# Altium project Assignment2.PrjPcb (part 2 of 2)

## Sheet SCH - Peripheral.SchDoc
size A4; CompanyName: James Cook University; DrawnBy1: Liam McLaren; Organization: James Cook University; Title1: Assignment 2 - qfuse; Revision: 1.6; SheetNumber: 3; SheetTotal: 4; Title2: IMU & Oscillator; DrawnBy2: Jacob Finger; ProjectName: *ProjectName
Used 3 times, as channels Designator, Designator, Designator. Parts and nets are listed once, with the designators drawn on the sheet.
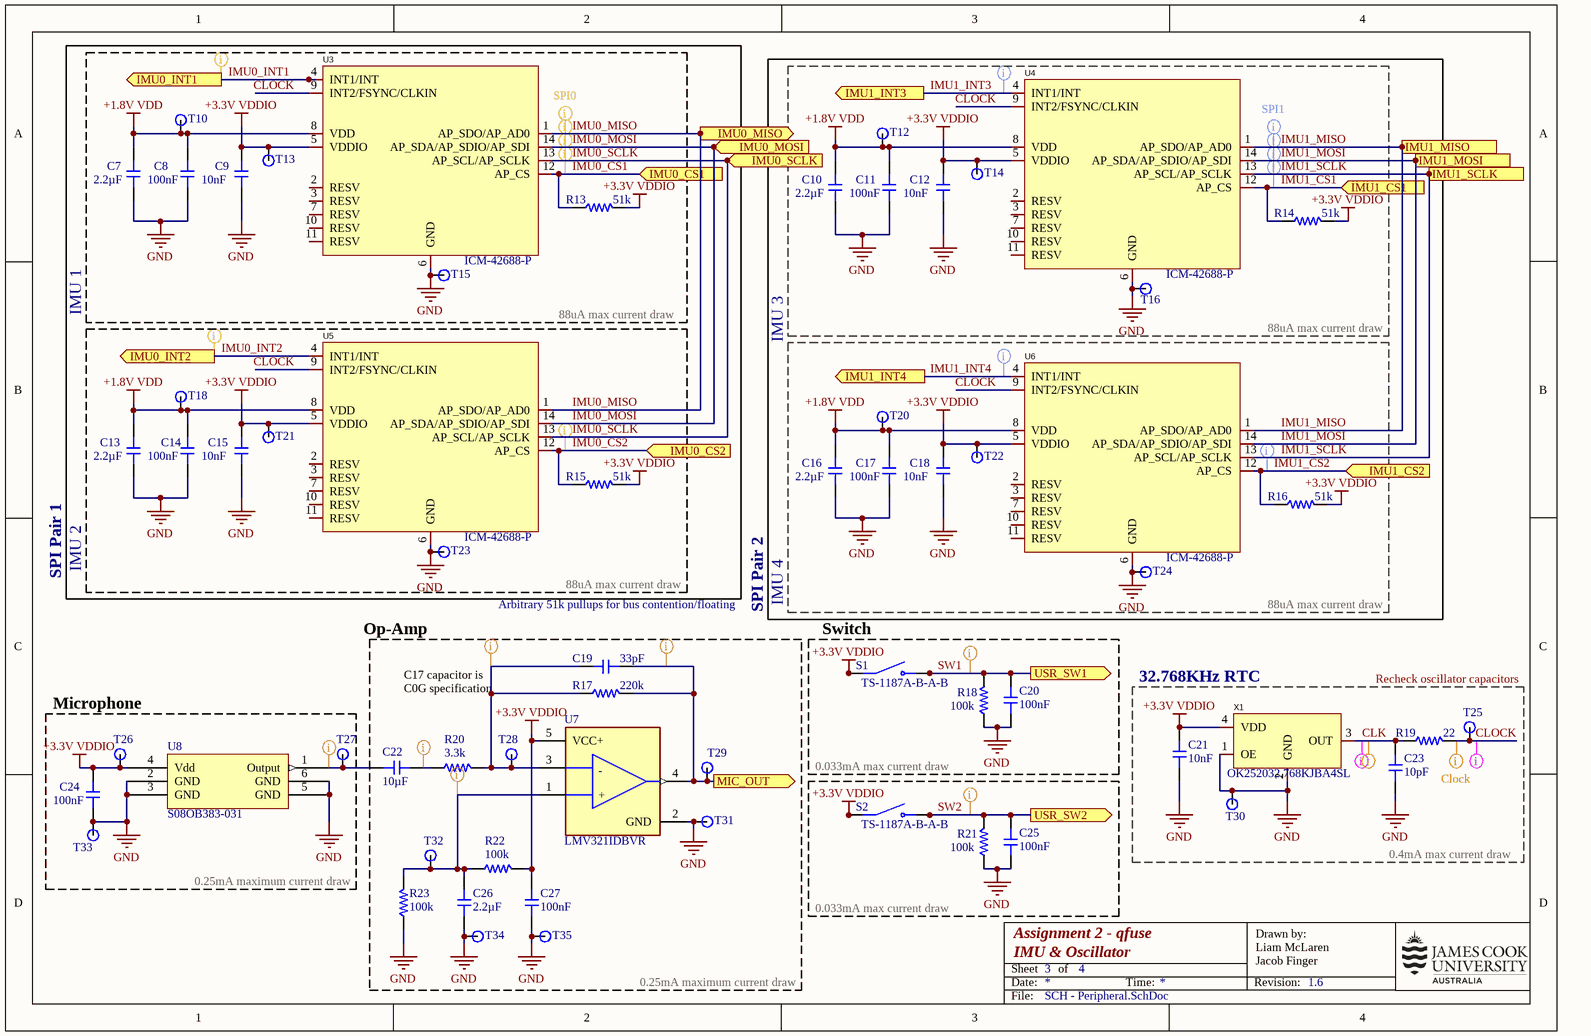
[diagram p2: SCH - Peripheral.SchDoc]

### Parts
C7  value 2.2µF  [CAP-0402]  (hidden comment: CL05A225MQ5NSNC)
C8  value 100nF  [CAP-0402]  (hidden comment: CL05B104KB54PNC)
C9  value 10nF  [CAP-0402]  (hidden comment: CL05B103KB5NNNC)
C10  value 2.2µF  [CAP-0402]  (hidden comment: CL05A225MQ5NSNC)
C11  value 100nF  [CAP-0402]  (hidden comment: CL05B104KB54PNC)
C12  value 10nF  [CAP-0402]  (hidden comment: CL05B103KB5NNNC)
C13  value 2.2µF  [CAP-0402]  (hidden comment: CL05A225MQ5NSNC)
C14  value 100nF  [CAP-0402]  (hidden comment: CL05B104KB54PNC)
C15  value 10nF  [CAP-0402]  (hidden comment: CL05B103KB5NNNC)
C16  value 2.2µF  [CAP-0402]  (hidden comment: CL05A225MQ5NSNC)
C17  value 100nF  [CAP-0402]  (hidden comment: CL05B104KB54PNC)
C18  value 10nF  [CAP-0402]  (hidden comment: CL05B103KB5NNNC)
C19  value 33pF  [CAP-0402]  (hidden comment: 0402CG330J500NT)
C20  value 100nF  [CAP-0402]  (hidden comment: CL05B104KO5NNNC)
C21  value 10nF  [CAP-0402]  (hidden comment: CL05B103KB5NNNC)
C22  value 10µF  [CAP-0402]  (hidden comment: CL05A106MQ5NUNC)
C23  value 10pF  [CAP-0402]  (hidden comment: CL05C100JB5NNNC)
C24  value 100nF  [CAP-0402]  (hidden comment: CL05B104KB54PNC)
C25  value 100nF  [CAP-0402]  (hidden comment: CL05B104KO5NNNC)
C26  value 2.2µF  [CAP-0402]  (hidden comment: CL05A225MQ5NSNC)
C27  value 100nF  [CAP-0402]  (hidden comment: CL05B104KB54PNC)
R13  value 51k  [RES-0402]  (hidden comment: 0402WGF5102TCE)
R14  value 51k  [RES-0402]  (hidden comment: 0402WGF5102TCE)
R15  value 51k  [RES-0402]  (hidden comment: 0402WGF5102TCE)
R16  value 51k  [RES-0402]  (hidden comment: 0402WGF5102TCE)
R17  value 220k  [RES-0603]  (hidden comment: 0603WAF2203T5E)
R18  value 100k  [RES-0402]  (hidden comment: 0402WGF1003TCE)
R19  value 22  [RES-0402]  (hidden comment: 0402WGF220JTCE)
R20  value 3.3k  [RES-0402]  (hidden comment: 0402WGF3301TCE)
R21  value 100k  [RES-0402]  (hidden comment: 0402WGF1003TCE)
R22  value 100k  [RES-0402]  (hidden comment: 0402WGF1003TCE)
R23  value 100k  [RES-0402]  (hidden comment: 0402WGF1003TCE)
S1  TS-1187A-B-A-B  [SW_TS-1187A-B-A-B]
S2  TS-1187A-B-A-B  [SW_TS-1187A-B-A-B]
T10  TP  [TestPoint]  (value not drawn)  (no BOM)
T12  TP  [TestPoint]  (value not drawn)  (no BOM)
T13  TP  [TestPoint]  (value not drawn)  (no BOM)
T14  TP  [TestPoint]  (value not drawn)  (no BOM)
T15  TP  [TestPoint]  (value not drawn)  (no BOM)
T16  TP  [TestPoint]  (value not drawn)  (no BOM)
T18  TP  [TestPoint]  (value not drawn)  (no BOM)
T20  TP  [TestPoint]  (value not drawn)  (no BOM)
T21  TP  [TestPoint]  (value not drawn)  (no BOM)
T22  TP  [TestPoint]  (value not drawn)  (no BOM)
T23  TP  [TestPoint]  (value not drawn)  (no BOM)
T24  TP  [TestPoint]  (value not drawn)  (no BOM)
T25  TP  [TestPoint]  (value not drawn)  (no BOM)
T26  TP  [TestPoint]  (value not drawn)  (no BOM)
T27  TP  [TestPoint]  (value not drawn)  (no BOM)
T28  TP  [TestPoint]  (value not drawn)  (no BOM)
T29  TP  [TestPoint]  (value not drawn)  (no BOM)
T30  TP  [TestPoint]  (value not drawn)  (no BOM)
T31  TP  [TestPoint]  (value not drawn)  (no BOM)
T32  TP  [TestPoint]  (value not drawn)  (no BOM)
T33  TP  [TestPoint]  (value not drawn)  (no BOM)
T34  TP  [TestPoint]  (value not drawn)  (no BOM)
T35  TP  [TestPoint]  (value not drawn)  (no BOM)
U3  ICM-42688-P  [LGA-14_L3.0-W2.5-P0.50-TL]
U4  ICM-42688-P  [LGA-14_L3.0-W2.5-P0.50-TL]
U5  ICM-42688-P  [LGA-14_L3.0-W2.5-P0.50-TL]
U6  ICM-42688-P  [LGA-14_L3.0-W2.5-P0.50-TL]
U7  LMV321IDBVR  [FP-DBV0005A-MFG]
U8  S08OB383-031  [Goertek_S08OB381-026]
X1  OK252032.768KJBA4SL  [OSC-SMD_4P-L2.5-W2.0-BL]

### Blocks framed on the sheet
IMU 1: C7-C9 R13 T10 T13 T15 U3
88uA max current draw: C10-C12 R14 T12 T14 T16 U4
0.25mA maximum current draw: C19 C22 C26 C27 R17 R20 R22 R23 T28 T29 T31 T32 T34 T35 U7
Switch: C20 R18 S1
Microphone: C24 T26 T27 T33 U8
32.768KHz RTC: C21 C23 R19 T25 T30 X1

### Ports
IMU0_CS1 (in, see SCH - Compute, Flash[3A], SCH - Power, Connector[4B]), IMU0_CS2 (in, see SCH - Compute, Flash[3A], SCH - Power, Connector[4B]), IMU0_INT1 (out, see SCH - Compute, Flash[3A], SCH - Power, Connector[4B]), IMU0_INT2 (out, see SCH - Compute, Flash[3A], SCH - Power, Connector[4A]), IMU0_MISO (out, see SCH - Compute, Flash[3A], SCH - Power, Connector[3B]), IMU0_MOSI (in, see SCH - Compute, Flash[3A], SCH - Power, Connector[3A]), IMU0_SCLK (in, see SCH - Compute, Flash[3A], SCH - Power, Connector[3B]), IMU1_CS1 (in, see SCH - Compute, Flash[3A], SCH - Power, Connector[4A]), IMU1_CS2 (in, see SCH - Compute, Flash[3B], SCH - Power, Connector[3A]), IMU1_INT3 (out, see SCH - Compute, Flash[3B], SCH - Power, Connector[4B]), IMU1_INT4 (out, see SCH - Compute, Flash[3B], SCH - Power, Connector[3B]), IMU1_MISO (out, see SCH - Compute, Flash[3B], SCH - Power, Connector[3B]), IMU1_MOSI (in, see SCH - Compute, Flash[3B], SCH - Power, Connector[4B]), IMU1_SCLK (in, see SCH - Compute, Flash[3A], SCH - Power, Connector[4B]), MIC_OUT (out, see SCH - Compute, Flash[3B]), USR_SW1 (out, see SCH - Compute, Flash[3B], SCH - Power, Connector[3B]), USR_SW2 (out, see SCH - Compute, Flash[3B], SCH - Power, Connector[3B])

### Nets
+1.8V VDD: C7.2 C8.2 C10.2 C11.2 C13.2 C14.2 C16.2 C17.2 T10.1(TP) T12.1(TP) T18.1(TP) T20.1(TP) U3.8(VDD) U4.8(VDD) U5.8(VDD) U6.8(VDD)
+3.3V VDDIO: C9.2 C12.2 C15.2 C18.2 C21.2 C24.2 C27.2 R13.2 R14.2 R15.2 R16.2 R22.2 S1.A(COM) S1.B(COM) S2.A(COM) S2.B(COM) T13.1(TP) T14.1(TP) T21.1(TP) T22.1(TP) T26.1(TP) U3.5(VDDIO) U4.5(VDDIO) U5.5(VDDIO) U6.5(VDDIO) U7.5(VCC+) U8.4(Vdd) X1.4(VDD)
GND: C7.1 C8.1 C9.1 C10.1 C11.1 C12.1 C13.1 C14.1 C15.1 C16.1 C17.1 C18.1 C20.1 C21.1 C23.1 C24.1 C25.1 C26.1 C27.1 R18.1 R21.1 R23.1 T15.1(TP) T16.1(TP) T23.1(TP) T24.1(TP) T30.1(TP) T31.1(TP) T33.1(TP) T34.1(TP) T35.1(TP) U3.6(GND) U4.6(GND) U5.6(GND) U6.6(GND) U7.2(GND) U8.2(GND) U8.3(GND) U8.5(GND) U8.6(GND) X1.1(OE) X1.2(GND)
CLK: C23.2 R19.1 X1.3(OUT)
CLOCK: R19.2 T25.1(TP) U3.9(INT2/FSYNC/CLKIN) U4.9(INT2/FSYNC/CLKIN) U5.9(INT2/FSYNC/CLKIN) U6.9(INT2/FSYNC/CLKIN)
IMU0_CS1: R13.1 U3.12(AP_CS) ; port IMU0_CS1
IMU0_CS2: R15.1 U5.12(AP_CS) ; port IMU0_CS2
IMU0_INT1: U3.4(INT1/INT) ; port IMU0_INT1
IMU0_INT2: U5.4(INT1/INT) ; port IMU0_INT2
IMU0_MISO: U3.1(AP_SDO/AP_AD0) U5.1(AP_SDO/AP_AD0) ; port IMU0_MISO
IMU0_MOSI: U3.14(AP_SDA/AP_SDIO/AP_SDI) U5.14(AP_SDA/AP_SDIO/AP_SDI) ; port IMU0_MOSI
IMU0_SCLK: U3.13(AP_SCL/AP_SCLK) U5.13(AP_SCL/AP_SCLK) ; port IMU0_SCLK
IMU1_CS1: R14.1 U4.12(AP_CS) ; port IMU1_CS1
IMU1_CS2: R16.1 U6.12(AP_CS) ; port IMU1_CS2
IMU1_INT3: U4.4(INT1/INT) ; port IMU1_INT3
IMU1_INT4: U6.4(INT1/INT) ; port IMU1_INT4
IMU1_MISO: U4.1(AP_SDO/AP_AD0) U6.1(AP_SDO/AP_AD0) ; port IMU1_MISO
IMU1_MOSI: U4.14(AP_SDA/AP_SDIO/AP_SDI) U6.14(AP_SDA/AP_SDIO/AP_SDI) ; port IMU1_MOSI
IMU1_SCLK: U4.13(AP_SCL/AP_SCLK) U6.13(AP_SCL/AP_SCLK) ; port IMU1_SCLK
MIC_OUT: C19.2 R17.2 T29.1(TP) U7.4(OUT) ; port MIC_OUT
SW1: C20.2 R18.2 S1.C(NO) S1.D(NO) ; port USR_SW1
SW2: C25.2 R21.2 S2.C(NO) S2.D(NO) ; port USR_SW2
NetC19_1: C19.1 R17.1 R20.2 T28.1(TP) U7.3(1IN-)
NetC22_1: C22.1 T27.1(TP) U8.1(Output)
NetC22_2: C22.2 R20.1
NetC26_2: C26.2 R22.1 R23.2 T32.1(TP) U7.1(1IN+)

Not connected (* = marked no-connect by the designer): U3 2(RESV) 3(RESV) 7(RESV) 10(RESV) 11(RESV); U4 2(RESV) 3(RESV) 7(RESV) 10(RESV) 11(RESV); U5 2(RESV) 3(RESV) 7(RESV) 10(RESV) 11(RESV); U6 2(RESV) 3(RESV) 7(RESV) 10(RESV) 11(RESV)

### Channels
Designator: designators end in _Designator#1; ports IMU0_CS1=IMU0_CS1 IMU0_CS2=IMU0_CS2 IMU0_INT1=IMU0_INT1 IMU0_INT2=IMU0_INT2 IMU0_MISO=IMU0_MISO IMU0_MOSI=IMU0_MOSI IMU0_SCLK=IMU0_SCLK IMU1_CS1=IMU1_CS1 IMU1_CS2=IMU1_CS2 IMU1_INT3=IMU1_INT3 IMU1_INT4=IMU1_INT4 IMU1_MISO=IMU1_MISO IMU1_MOSI=IMU1_MOSI IMU1_SCLK=IMU1_SCLK MIC_OUT=MIC_IN USR_SW1=SW1 USR_SW2=SW2
Designator: designators end in _Designator#2; ports IMU0_CS1=IMU0_CS1 IMU0_CS2=IMU0_CS2 IMU0_INT1=IMU0_INT1 IMU0_INT2=IMU0_INT2 IMU0_MISO=IMU0_MISO IMU0_MOSI=IMU0_MOSI IMU0_SCLK=IMU0_SCLK IMU1_CS1=IMU1_CS1 IMU1_CS2=IMU1_CS2 IMU1_INT3=IMU1_INT3 IMU1_INT4=IMU1_INT4 IMU1_MISO=IMU1_MISO IMU1_MOSI=IMU1_MOSI IMU1_SCLK=IMU1_SCLK MIC_OUT=MIC_IN USR_SW1=SW1 USR_SW2=SW2
Designator: designators end in _Designator#3; ports IMU0_CS1=IMU0_CS1 IMU0_CS2=IMU0_CS2 IMU0_INT1=IMU0_INT1 IMU0_INT2=IMU0_INT2 IMU0_MISO=IMU0_MISO IMU0_MOSI=IMU0_MOSI IMU0_SCLK=IMU0_SCLK IMU1_CS1=IMU1_CS1 IMU1_CS2=IMU1_CS2 IMU1_INT3=IMU1_INT3 IMU1_INT4=IMU1_INT4 IMU1_MISO=IMU1_MISO IMU1_MOSI=IMU1_MOSI IMU1_SCLK=IMU1_SCLK MIC_OUT=MIC_IN USR_SW1=SW1 USR_SW2=SW2

### Layout directives
net class Signals: CLK_Designator, CLOCK_Designator, MIC_IN, NetC19_Designator#1_1, NetC22_Designator#1_1, NetC22_Designator#1_2, NetC26_Designator#1_2, SW1, SW2
net class Clock: CLK_Designator, CLOCK_Designator
net class SPI0: IMU0_CS1, IMU0_CS2, IMU0_INT1, IMU0_INT2, IMU0_MISO, IMU0_MOSI, IMU0_SCLK
net class SPI1: IMU1_CS1, IMU1_CS2, IMU1_INT3, IMU1_INT4, IMU1_MISO, IMU1_MOSI, IMU1_SCLK

### Notes on the sheet
- 88uA max current draw
- IMU 3
- SPI Pair 1
- IMU 2
- Op-Amp
- Arbitrary 51k pullups for bus contention/floating
- SPI Pair 2
- IMU 4
- C17 capacitor is C0G specification
- Recheck oscillator capacitors
- 0.033mA max current draw
- (near R23) 0.25mA maximum current draw
- 0.4mA max current draw
- Date:
- Sheet
- of
- Time:
- Revision:
- Drawn by:
- File:
- (in symbol CMP-00012-2) +

### Library data of the parts
C7 C10 C13 C16 C26 = CMP-001-00142-3: Capacitor, Ceramic (MLCC), 2.2uF, ±20%, 6.3V, X5R, ±20%, SMD 0402; Manufacturer: Samsung Electro-Mechanics; Category: Capacitors - MLCC; Case/Package: 0402; ComponentLink1URL: https://datasheet.lcsc.com/lcsc/1811021410_Samsung-Electro-Mechanics-CL05A225MQ5NSNC_C12530.pdf; Temperature Coefficient: X5R; Tolerance: 20%; Design Item ID: CL05A225MQ5NSNC; JLCPCB Part Number: C12530; Voltage Rating: 6.3V; ComponentLink1Description: Datasheet; ComponentLink2URL: https://jlcpcb.com/partdetail/C12530; Source: jlcpcb_capacitors_basic.schlib; Manufacturer Part Number: CL05A225MQ5NSNC; RoHS: Yes; ComponentLink2Description: JLCPCB Part URL; ComponentLink3Description: LCSC Part URL; JLCPCB Basic Part: Yes; ComponentLink3URL: https://lcsc.com/product-detail/Multilayer-Ceramic-Capacitors-MLCC---SMD-SMT_Samsung-Electro-Mechanics-Samsung-Electro-Mechanics-CL05A225MQ5NSNC_C12530.html
C8 C11 C14 C17 C24 C27 = CMP-001-00146-3: Capacitor, Ceramic (MLCC), 100nF, ±10%, 50V, X7R, ±10%, SMD 0402; Manufacturer: Samsung Electro-Mechanics; Source: jlcpcb_capacitors_basic.schlib; ComponentLink2URL: https://jlcpcb.com/partdetail/C307331; JLCPCB Part Number: C307331; JLCPCB Basic Part: Yes; Voltage Rating: 50V; Manufacturer Part Number: CL05B104KB54PNC; RoHS: Yes; Case/Package: 0402; Temperature Coefficient: X7R; ComponentLink1URL: https://datasheet.lcsc.com/lcsc/1810191222_Samsung-Electro-Mechanics-CL05B104KB54PNC_C307331.pdf; Category: Capacitors - MLCC; ComponentLink2Description: JLCPCB Part URL; ComponentLink3Description: LCSC Part URL; Design Item ID: CL05B104KB54PNC; ComponentLink3URL: https://lcsc.com/product-detail/Multilayer-Ceramic-Capacitors-MLCC---SMD-SMT_Samsung-Electro-Mechanics-Samsung-Electro-Mechanics-CL05B104KB54PNC_C307331.html; ComponentLink1Description: Datasheet; Tolerance: 10%
C9 C12 C15 C18 C21 = CMP-001-00145-3: Capacitor, Ceramic (MLCC), 10nF, ±10%, 50V, X7R, ±10%, SMD 0402; Manufacturer: Samsung Electro-Mechanics; JLCPCB Part Number: C15195; Case/Package: 0402; ComponentLink1URL: https://datasheet.lcsc.com/lcsc/1810191223_Samsung-Electro-Mechanics-CL05B103KB5NNNC_C15195.pdf; ComponentLink3Description: LCSC Part URL; Design Item ID: CL05B103KB5NNNC; Source: jlcpcb_capacitors_basic.schlib; JLCPCB Basic Part: Yes; Voltage Rating: 50V; RoHS: Yes; Tolerance: 10%; ComponentLink1Description: Datasheet; ComponentLink3URL: https://lcsc.com/product-detail/Multilayer-Ceramic-Capacitors-MLCC---SMD-SMT_Samsung-Electro-Mechanics-Samsung-Electro-Mechanics-CL05B103KB5NNNC_C15195.html; Category: Capacitors - MLCC; ComponentLink2Description: JLCPCB Part URL; ComponentLink2URL: https://jlcpcb.com/partdetail/C15195; Temperature Coefficient: X7R; Manufacturer Part Number: CL05B103KB5NNNC
C19 = CMP-001-00127-3: Capacitor, Ceramic (MLCC), 33pF, ±5%, 50V, C0G, ±5%, SMD 0402; Manufacturer: FH(Guangdong Fenghua Advanced Tech); ComponentLink3URL: https://lcsc.com/product-detail/Multilayer-Ceramic-Capacitors-MLCC---SMD-SMT_FH-Guangdong-Fenghua-Advanced-Tech-FH-Guangdong-Fenghua-Advanced-Tech-0402CG330J500NT_C1562.html; Tolerance: 5%; ComponentLink1URL: https://datasheet.lcsc.com/lcsc/1811141731_FH--Guangdong-Fenghua-Advanced-Tech-0402CG330J500NT_C1562.pdf; Source: jlcpcb_capacitors_basic.schlib; ComponentLink2URL: https://jlcpcb.com/partdetail/C1562; ComponentLink2Description: JLCPCB Part URL; RoHS: Yes; Design Item ID: 0402CG330J500NT; Manufacturer Part Number: 0402CG330J500NT; Voltage Rating: 50V; JLCPCB Basic Part: Yes; Case/Package: 0402; Category: Capacitors - MLCC; ComponentLink3Description: LCSC Part URL; JLCPCB Part Number: C1562; ComponentLink1Description: Datasheet; Temperature Coefficient: C0G
C20 C25 = CMP-001-00147-3: Capacitor, Ceramic (MLCC), 100nF, ±10%, 16V, X7R, ±10%, SMD 0402; Manufacturer: Samsung Electro-Mechanics; Manufacturer Part Number: CL05B104KO5NNNC; ComponentLink1Description: Datasheet; RoHS: Yes; Voltage Rating: 16V; ComponentLink2URL: https://jlcpcb.com/partdetail/C1525; Temperature Coefficient: X7R; ComponentLink2Description: JLCPCB Part URL; JLCPCB Part Number: C1525; ComponentLink3URL: https://lcsc.com/product-detail/Multilayer-Ceramic-Capacitors-MLCC---SMD-SMT_Samsung-Electro-Mechanics-Samsung-Electro-Mechanics-CL05B104KO5NNNC_C1525.html; ComponentLink3Description: LCSC Part URL; Source: jlcpcb_capacitors_basic.schlib; Design Item ID: CL05B104KO5NNNC; Category: Capacitors - MLCC; ComponentLink1URL: https://datasheet.lcsc.com/lcsc/1810191219_Samsung-Electro-Mechanics-CL05B104KO5NNNC_C1525.pdf; JLCPCB Basic Part: Yes; Tolerance: 10%; Case/Package: 0402
C22 = CMP-001-00141-3: Capacitor, Ceramic (MLCC), 10uF, ±20%, 6.3V, X5R, ±20%, SMD 0402; Manufacturer: Samsung Electro-Mechanics; JLCPCB Part Number: C15525; Tolerance: 20%; Temperature Coefficient: X5R; ComponentLink2Description: JLCPCB Part URL; ComponentLink3Description: LCSC Part URL; Voltage Rating: 6.3V; ComponentLink1Description: Datasheet; ComponentLink1URL: https://datasheet.lcsc.com/lcsc/2208231630_Samsung-Electro-Mechanics-CL05A106MQ5NUNC_C15525.pdf; RoHS: Yes; Case/Package: 0402; ComponentLink2URL: https://jlcpcb.com/partdetail/C15525; Manufacturer Part Number: CL05A106MQ5NUNC; Design Item ID: CL05A106MQ5NUNC; Source: jlcpcb_capacitors_basic.schlib; Category: Capacitors - MLCC; ComponentLink3URL: https://lcsc.com/product-detail/Multilayer-Ceramic-Capacitors-MLCC---SMD-SMT_Samsung-Electro-Mechanics-Samsung-Electro-Mechanics-CL05A106MQ5NUNC_C15525.html; JLCPCB Basic Part: Yes
C23 = CMP-001-00150-3: Capacitor, Ceramic (MLCC), 10pF, ±5%, 50V, C0G, ±5%, SMD 0402; Manufacturer: Samsung Electro-Mechanics; ComponentLink3Description: LCSC Part URL; Category: Capacitors - MLCC; ComponentLink1Description: Datasheet; RoHS: Yes; JLCPCB Part Number: C32949; ComponentLink3URL: https://lcsc.com/product-detail/Multilayer-Ceramic-Capacitors-MLCC---SMD-SMT_Samsung-Electro-Mechanics-Samsung-Electro-Mechanics-CL05C100JB5NNNC_C32949.html; Source: jlcpcb_capacitors_basic.schlib; Manufacturer Part Number: CL05C100JB5NNNC; ComponentLink2URL: https://jlcpcb.com/partdetail/C32949; JLCPCB Basic Part: Yes; ComponentLink1URL: https://datasheet.lcsc.com/lcsc/1810191220_Samsung-Electro-Mechanics-CL05C100JB5NNNC_C32949.pdf; Design Item ID: CL05C100JB5NNNC; Voltage Rating: 50V; Temperature Coefficient: C0G; Tolerance: 5%; ComponentLink2Description: JLCPCB Part URL; Case/Package: 0402
R13-R16 = CMP-009-00226-4: Resistor, 51kΩ, ±1%, 62.5mW, 50V, ±100ppm/℃, -55℃~+155℃, SMD 0402; Manufacturer: Uniroyal; Temperature Rating: -55℃~+155℃; Category: Resistors; ComponentLink1URL: https://datasheet.lcsc.com/lcsc/2206010100_UNI-ROYAL-Uniroyal-Elec-0402WGF5102TCE_C25794.pdf; JLCPCB Part Number: C25794; Manufacturer Part Number: 0402WGF5102TCE; Voltage Rating: 50V; Case/Package: 0402; Design Item ID: 0402WGF5102TCE; JLCPCB Basic Part: Yes; ComponentLink2Description: JLCPCB Part URL; Tolerance: 1%; ComponentLink2URL: https://jlcpcb.com/partdetail/C25794; Temperature Coefficient: ±100ppm/℃; Source: jlcpcb_resistors_basic.schlib; ComponentLink1Description: Datasheet; Power Rating: 62.5mW
R17 = CMP-009-00277-2: Resistor, 220kΩ, ±1%, 100mW, 75V, ±100ppm/℃, -55℃~+155℃, SMD 0603; Manufacturer: Uniroyal; Temperature Coefficient: ±100ppm/℃; Tolerance: 1%; ComponentLink2URL: https://jlcpcb.com/partdetail/C22961; Source: jlcpcb_resistors_basic.schlib; Case/Package: 0603; Category: Resistors; Manufacturer Part Number: 0603WAF2203T5E; Voltage Rating: 75V; Design Item ID: 0603WAF2203T5E; ComponentLink1URL: https://datasheet.lcsc.com/lcsc/2206010130_UNI-ROYAL-Uniroyal-Elec-0603WAF2203T5E_C22961.pdf; JLCPCB Part Number: C22961; Power Rating: 100mW; ComponentLink1Description: Datasheet; ComponentLink2Description: JLCPCB Part URL; Temperature Rating: -55℃~+155℃; JLCPCB Basic Part: Yes
R18 R21-R23 = CMP-009-00182-4: Resistor, 100kΩ, ±1%, 62.5mW, 50V, ±100ppm/℃, -55℃~+155℃, SMD 0402; Manufacturer: Uniroyal; ComponentLink1Description: Datasheet; Voltage Rating: 50V; ComponentLink2URL: https://jlcpcb.com/partdetail/C25741; Design Item ID: 0402WGF1003TCE; Tolerance: 1%; Case/Package: 0402; Manufacturer Part Number: 0402WGF1003TCE; ComponentLink2Description: JLCPCB Part URL; Source: jlcpcb_resistors_basic.schlib; JLCPCB Basic Part: Yes; Temperature Coefficient: ±100ppm/℃; Category: Resistors; Temperature Rating: -55℃~+155℃; JLCPCB Part Number: C25741; ComponentLink1URL: https://datasheet.lcsc.com/lcsc/2206010100_UNI-ROYAL-Uniroyal-Elec-0402WGF1003TCE_C25741.pdf; Power Rating: 62.5mW
R19 = CMP-009-00204-4: Resistor, 22Ω, ±1%, 62.5mW, 50V, ±200ppm/℃, -55℃~+155℃, SMD 0402; Manufacturer: Uniroyal; ComponentLink1URL: https://datasheet.lcsc.com/lcsc/2205311900_UNI-ROYAL-Uniroyal-Elec-0402WGF220JTCE_C25092.pdf; Source: jlcpcb_resistors_basic.schlib; ComponentLink2URL: https://jlcpcb.com/partdetail/C25092; Design Item ID: 0402WGF220JTCE; Temperature Rating: -55℃~+155℃; Manufacturer Part Number: 0402WGF220JTCE; Temperature Coefficient: ±200ppm/℃; JLCPCB Part Number: C25092; Case/Package: 0402; ComponentLink2Description: JLCPCB Part URL; Power Rating: 62.5mW; JLCPCB Basic Part: Yes; Category: Resistors; ComponentLink1Description: Datasheet; Voltage Rating: 50V; Tolerance: 1%
R20 = CMP-009-00211-4: Resistor, 3.3kΩ, ±1%, 62.5mW, 50V, ±100ppm/℃, -55℃~+155℃, SMD 0402; Manufacturer: Uniroyal; JLCPCB Part Number: C25890; Design Item ID: 0402WGF3301TCE; Temperature Rating: -55℃~+155℃; Voltage Rating: 50V; JLCPCB Basic Part: Yes; Power Rating: 62.5mW; Source: jlcpcb_resistors_basic.schlib; ComponentLink2Description: JLCPCB Part URL; Temperature Coefficient: ±100ppm/℃; Case/Package: 0402; ComponentLink1URL: https://datasheet.lcsc.com/lcsc/2206010045_UNI-ROYAL-Uniroyal-Elec-0402WGF3301TCE_C25890.pdf; Manufacturer Part Number: 0402WGF3301TCE; ComponentLink2URL: https://jlcpcb.com/partdetail/C25890; ComponentLink1Description: Datasheet; Category: Resistors; Tolerance: 1%
S1 S2 = CMP-051-000000-5: SPST 50mA @ 12VDC Top Actuated Round Button 160gf SMD Tactile Switches RoHS; Availability: Unavailable; Value: *; Price: None; Design Item ID: TS-1187A-B-A-B; Component Type: Standard; Pin Count: 4; Source: TS-1187A-B-A-B.SchLib; MP: TS-1187A-B-A-B; Package: None; JLCPCB Part Number: C318884
T10 T12-T16 T18 T20-T35 = TestPoint
U3-U6 = ICM-42688-P: ICM-42688-P LGA-14(2.5x3) Attitude Sensor/Gyroscope; Manufacturer: TDK InvenSense(应美盛); Add into BOM: yes; Sensor Type: 加速度计陀螺仪; LCSC Part Name: ICM-42688-P; Manufacturer Part: ICM-42688-P; JLCPCB Part Class: Extended Part; Datasheet: https://atta.szlcsc.com/upload/public/pdf/source/20210703/CF24204867ACE5B754A2B035F23E5931.pdf; Supplier: LCSC; Convert to PCB: yes; Device: ICM-42688-P; Symbol: ICM-42688-P; LCSC Part #: C1850418; JLCPCB Part #: C1850418; Supplier Footprint: LGA-14(2.5x3); JLCPCB Part Number: C1850418
U7 = CMP-00012-2: General Purpose Amplifier 1 Circuit Rail-to-Rail SOT-23-5; Input Offset Voltage (Vos): 7mV; Number of Amplifiers: 1; Input Bias Current: 250nA; Max Supply Voltage: 5.5V; Min Supply Voltage: 2.7V; Voltage Gain: 100dB; Supply Current: 250uA; Operating Supply Current: 130uA; Output Current: 160mA; Power Supply Rejection Ratio (PSRR): 50dB; Unity Gain Bandwidth Product: 1MHz; Slew Rate: 1V/µs; Radiation Hardening: No; Case/Package: SOT-23-5; Amplifier Type: GENERAL PURPOSE; Contact Plating: Tin,Matte; Packaging: Tape and Reel; Number of Circuits: 1; Nominal Supply Current: 250uA; Mount: Surface Mount; Technology: BICMOS; Series: -; REACH SVHC: No SVHC; Output Current per Channel: 160mA; Max Operating Temperature: 125°C; Number of Elements: 1; Number of Channels: 1; Number of Pins: 5; Lead Free: Lead Free; Bandwidth: 1MHz; Gain Bandwidth Product: 1MHz; RoHS Compliant: Yes; Min Operating Temperature: -40°C; Common Mode Rejection Ratio: 50dB; Package Quantity: 1; JLCPCB Part Number: C7972
U8 = CMP-00027-00000-1: MEMS Microphone SMD 3.76x3x1.1mm; JLCPCB Part Number: C233789
X1 = OK252032.768KJBA4SL: YXC Crystal Oscillators - OK252032.768KJBA4SL - SMD2520-4P - 1.8V~3.3V ±10ppm 5mA ±20ppm CMOS 32.768kHz SMD2520-4P Crystal Oscillators ROHS; Manufacturer: HELE(台湾加高); Add into BOM: yes; Supply Voltage: 3.3V; Supply Current (Max): 3mA; Frequency Stability(Full temperature range): ±30ppm; Symbol: OK252032.768KJBA4SL; Device: OK252032.768KJBA4SL; LCSC Part Name: OK252032.768KJBA4SL; Supplier Part: C669098; Manufacturer Part: OK252032.768KJBA4SL; Supplier Footprint: SMD2520-4P; JLCPCB Part Class: Extended Part; Datasheet: https://atta.szlcsc.com/upload/public/pdf/source/20190430/C253914_C770A64EFF6E6E62846100D666617C6C.pdf; Supplier: LCSC; Convert to PCB: yes; Value: 32.768kHz; Operating Temperature: -30℃~+85℃; LCSC Part #: C669098; JLCPCB Part Number: C669098

## Sheet SCH - Wireless Coms.SchDoc
size A4; CompanyName: James Cook University; DrawnBy1: Jacob Finger; Organization: James Cook University; Title1: Assignment 2 - qfuse; Revision: 1.6; SheetNumber: 4; SheetTotal: 4; Title2: Wireless Coms; DrawnBy2: Liam McLaren; ProjectName: *ProjectName
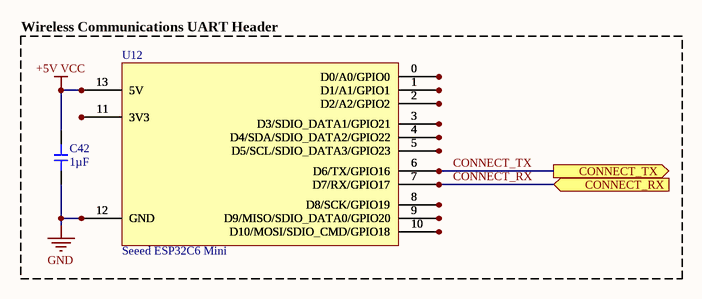
[diagram p3: SCH - Wireless Coms.SchDoc]

### Parts
C42  value 1µF  [CAP-0402]  (hidden comment: CL05A105KA5NQNC)
U12  Seeed ESP32C6 Mini  [ESP32C6 Mini]  (no BOM)

### Blocks framed on the sheet
Wireless Communications UART Header: C42 U12

### Ports
CONNECT_RX (in, see SCH - Compute, Flash[3C], SCH - Power, Connector[4A]), CONNECT_TX (out, see SCH - Compute, Flash[3C], SCH - Power, Connector[4A])

### Nets
+5V VCC: C42.2 U12.13(5V)
GND: C42.1 U12.12(GND)
CONNECT_RX: U12.7(D7/RX/GPIO17) ; port CONNECT_RX
CONNECT_TX: U12.6(D6/TX/GPIO16) ; port CONNECT_TX

Not connected (* = marked no-connect by the designer): U12 0(D0/A0/GPIO0) 1(D1/A1/GPIO1) 2(D2/A2/GPIO2) 3(D3/SDIO_DATA1/GPIO21) 4(D4/SDA/SDIO_DATA2/GPIO22) 5(D5/SCL/SDIO_DATA3/GPIO23) 8(D8/SCK/GPIO19) 9(D9/MISO/SDIO_DATA0/GPIO20) 10(D10/MOSI/SDIO_CMD/GPIO18) 11(3V3)

### Notes on the sheet
- Date:
- Sheet
- of
- Time:
- Revision:
- Drawn by:
- File:

### Library data of the parts
C42 = CMP-001-00140-3: Capacitor, Ceramic (MLCC), 1uF, ±10%, 25V, X5R, ±10%, SMD 0402; Manufacturer: Samsung Electro-Mechanics; Case/Package: 0402; ComponentLink2Description: JLCPCB Part URL; Manufacturer Part Number: CL05A105KA5NQNC; RoHS: Yes; Temperature Coefficient: X5R; Tolerance: 10%; ComponentLink2URL: https://jlcpcb.com/partdetail/C52923; ComponentLink1URL: https://datasheet.lcsc.com/lcsc/1811091611_Samsung-Electro-Mechanics-CL05A105KA5NQNC_C52923.pdf; ComponentLink3URL: https://lcsc.com/product-detail/Multilayer-Ceramic-Capacitors-MLCC---SMD-SMT_Samsung-Electro-Mechanics-Samsung-Electro-Mechanics-CL05A105KA5NQNC_C52923.html; ComponentLink1Description: Datasheet; ComponentLink3Description: LCSC Part URL; JLCPCB Basic Part: Yes; Design Item ID: CL05A105KA5NQNC; JLCPCB Part Number: C52923; Source: jlcpcb_capacitors_basic.schlib; Category: Capacitors - MLCC; Voltage Rating: 25V
U12 = ESP32C6 Mini

## Nets that join several sheets
+1.8V VDD: SCH - Power, Connector (P6.1 R10.2 T7.1 U2.1), Designator (16 pins), Designator (16 pins), Designator (16 pins)
+3.3V VDDIO: SCH - Compute, Flash (24 pins), SCH - Power, Connector (P6.2 R8.2 T5.1 U2.14), Designator (28 pins), Designator (28 pins), Designator (28 pins)
+5V VCC: SCH - Power, Connector (8 pins), SCH - Wireless Coms (C42.2 U12.13)
GND: SCH - Compute, Flash (28 pins), SCH - Power, Connector (37 pins), Designator (42 pins), Designator (42 pins), Designator (42 pins), SCH - Wireless Coms (C42.1 U12.12)
CONNECT_CTS: SCH - Compute, Flash (U9.8), SCH - Power, Connector (P2.16)
CONNECT_RTS: SCH - Compute, Flash (U9.9), SCH - Power, Connector (P2.32)
CONNECT_RX: SCH - Compute, Flash (U9.7), SCH - Power, Connector (P2.10), SCH - Wireless Coms (U12.7)
CONNECT_TX: SCH - Compute, Flash (U9.6), SCH - Power, Connector (P2.8), SCH - Wireless Coms (U12.6)
DEBUG_RX: SCH - Compute, Flash (U9.2), SCH - Power, Connector (P3.7)
DEBUG_TX: SCH - Compute, Flash (U9.3), SCH - Power, Connector (P3.8)
EEPROM_SCL: SCH - Compute, Flash (R28.1 U11.6), SCH - Power, Connector (P2.28)
EEPROM_SDA: SCH - Compute, Flash (R27.1 U11.5), SCH - Power, Connector (P2.27)
I2C_SCL: SCH - Compute, Flash (U9.41), SCH - Power, Connector (P2.5 R2.1 U2.6)
I2C_SDA: SCH - Compute, Flash (U9.40), SCH - Power, Connector (P2.3 R5.1 U2.7)
IMU0_CS1: SCH - Compute, Flash (U9.12), SCH - Power, Connector (P2.24), Designator (R13_Designator#1.1 U3_Designator#1.12), Designator (R13_Designator#2.1 U3_Designator#2.12), Designator (R13_Designator#3.1 U3_Designator#3.12)
IMU0_CS2: SCH - Compute, Flash (U9.16), SCH - Power, Connector (P2.26), Designator (R15_Designator#1.1 U5_Designator#1.12), Designator (R15_Designator#2.1 U5_Designator#2.12), Designator (R15_Designator#3.1 U5_Designator#3.12)
IMU0_INT1: SCH - Compute, Flash (U9.17), SCH - Power, Connector (P2.22), Designator (U3_Designator#1.4), Designator (U3_Designator#2.4), Designator (U3_Designator#3.4)
IMU0_INT2: SCH - Compute, Flash (U9.18), SCH - Power, Connector (P2.18), Designator (U5_Designator#1.4), Designator (U5_Designator#2.4), Designator (U5_Designator#3.4)
IMU0_MISO: SCH - Compute, Flash (U9.15), SCH - Power, Connector (P2.21), Designator (U3_Designator#1.1 U5_Designator#1.1), Designator (U3_Designator#2.1 U5_Designator#2.1), Designator (U3_Designator#3.1 U5_Designator#3.1)
IMU0_MOSI: SCH - Compute, Flash (U9.14), SCH - Power, Connector (P2.19), Designator (U3_Designator#1.14 U5_Designator#1.14), Designator (U3_Designator#2.14 U5_Designator#2.14), Designator (U3_Designator#3.14 U5_Designator#3.14)
IMU0_SCLK: SCH - Compute, Flash (U9.13), SCH - Power, Connector (P2.23), Designator (U3_Designator#1.13 U5_Designator#1.13), Designator (U3_Designator#2.13 U5_Designator#2.13), Designator (U3_Designator#3.13 U5_Designator#3.13)
IMU1_CS1: SCH - Compute, Flash (U9.28), SCH - Power, Connector (P2.12), Designator (R14_Designator#1.1 U4_Designator#1.12), Designator (R14_Designator#2.1 U4_Designator#2.12), Designator (R14_Designator#3.1 U4_Designator#3.12)
IMU1_CS2: SCH - Compute, Flash (U9.32), SCH - Power, Connector (P2.11), Designator (R16_Designator#1.1 U6_Designator#1.12), Designator (R16_Designator#2.1 U6_Designator#2.12), Designator (R16_Designator#3.1 U6_Designator#3.12)
IMU1_INT3: SCH - Compute, Flash (U9.11), SCH - Power, Connector (P2.36), Designator (U4_Designator#1.4), Designator (U4_Designator#2.4), Designator (U4_Designator#3.4)
IMU1_INT4: SCH - Compute, Flash (U9.27), SCH - Power, Connector (P2.37), Designator (U6_Designator#1.4), Designator (U6_Designator#2.4), Designator (U6_Designator#3.4)
IMU1_MISO: SCH - Compute, Flash (U9.31), SCH - Power, Connector (P2.35), Designator (U4_Designator#1.1 U6_Designator#1.1), Designator (U4_Designator#2.1 U6_Designator#2.1), Designator (U4_Designator#3.1 U6_Designator#3.1)
IMU1_MOSI: SCH - Compute, Flash (U9.30), SCH - Power, Connector (P2.38), Designator (U4_Designator#1.14 U6_Designator#1.14), Designator (U4_Designator#2.14 U6_Designator#2.14), Designator (U4_Designator#3.14 U6_Designator#3.14)
IMU1_SCLK: SCH - Compute, Flash (U9.29), SCH - Power, Connector (P2.40), Designator (U4_Designator#1.13 U6_Designator#1.13), Designator (U4_Designator#2.13 U6_Designator#2.13), Designator (U4_Designator#3.13 U6_Designator#3.13)
MIC_IN: SCH - Compute, Flash (U9.38), Designator (C19_Designator#1.2 R17_Designator#1.2 T29_Designator#1.1 U7_Designator#1.4), Designator (C19_Designator#2.2 R17_Designator#2.2 T29_Designator#2.1 U7_Designator#2.4), Designator (C19_Designator#3.2 R17_Designator#3.2 T29_Designator#3.1 U7_Designator#3.4)
PWR_PV: SCH - Compute, Flash (U9.39), SCH - Power, Connector (P2.7 R9.1 U2.10)
SCREEN_SCL: SCH - Compute, Flash (U9.35), SCH - Power, Connector (P2.15 P4.2)
SCREEN_SDA: SCH - Compute, Flash (U9.34), SCH - Power, Connector (P2.13 P4.1)
SW1: SCH - Compute, Flash (U9.4), SCH - Power, Connector (P2.29), Designator (C20_Designator#1.2 R18_Designator#1.2 S1_Designator#1.C S1_Designator#1.D), Designator (C20_Designator#2.2 R18_Designator#2.2 S1_Designator#2.C S1_Designator#2.D), Designator (C20_Designator#3.2 R18_Designator#3.2 S1_Designator#3.C S1_Designator#3.D)
SW2: SCH - Compute, Flash (U9.5), SCH - Power, Connector (P2.31), Designator (C25_Designator#1.2 R21_Designator#1.2 S2_Designator#1.C S2_Designator#1.D), Designator (C25_Designator#2.2 R21_Designator#2.2 S2_Designator#2.C S2_Designator#2.D), Designator (C25_Designator#3.2 R21_Designator#3.2 S2_Designator#3.C S2_Designator#3.D)
SWCLK: SCH - Compute, Flash (U9.24), SCH - Power, Connector (P3.2 P5.1)
SWDIO: SCH - Compute, Flash (U9.25), SCH - Power, Connector (P3.4 P5.3)
USB_N: SCH - Compute, Flash (R25.1), SCH - Power, Connector (P1.2)
USB_P: SCH - Compute, Flash (R26.1), SCH - Power, Connector (P1.3)

## Assembly variants
Not Fitted for JLCPCB Manufacture: not fitted F1 F2 F3 P2 P3 P4 P5 P6 T1 T2 T3 T4 T5 T6 T7 T8 T9 T10 T11 T12 T13 T14 T15 T16 T18 T20 T21 T22 T23 T24 T25 T26 T27 T28 T29 T30 T31 T32 T33 T34 T35 T36 T37 T38 T39 U12